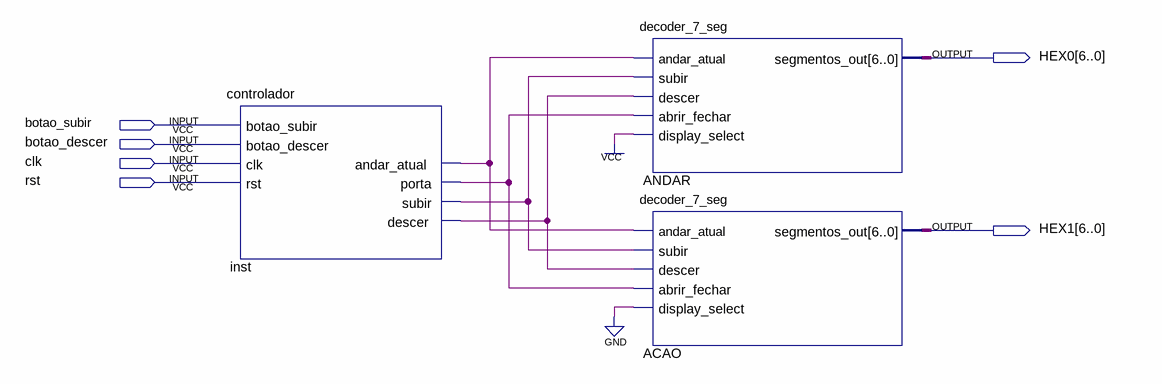
[diagram p0: schematic sheet]
// Quartus schematic Elevador.bdf as structural Verilog: 3 symbols, 6 pins
module Elevador (
  input  botao_subir,
  input  botao_descer,
  input  clk,
  input  rst,
  output [6:0] HEX0,
  output [6:0] HEX1
);

  wire inst_andar_atual, inst_descer, inst_porta, inst_subir;

  controlador inst (
    .botao_descer(botao_descer), .botao_subir(botao_subir), .clk(clk), .rst(rst),
    .andar_atual(inst_andar_atual), .descer(inst_descer), .porta(inst_porta), .subir(inst_subir));
  decoder_7_seg ANDAR (
    .andar_atual(inst_andar_atual), .subir(inst_subir), .descer(inst_descer), .abrir_fechar(inst_porta),
    .display_select(1'b1), .segmentos_out(HEX0));
  decoder_7_seg ACAO (
    .andar_atual(inst_andar_atual), .subir(inst_subir), .descer(inst_descer), .abrir_fechar(inst_porta),
    .display_select(1'b0), .segmentos_out(HEX1));
endmodule
